# EAGLE design external_strip_v1 (EAGLE 7.2.0)
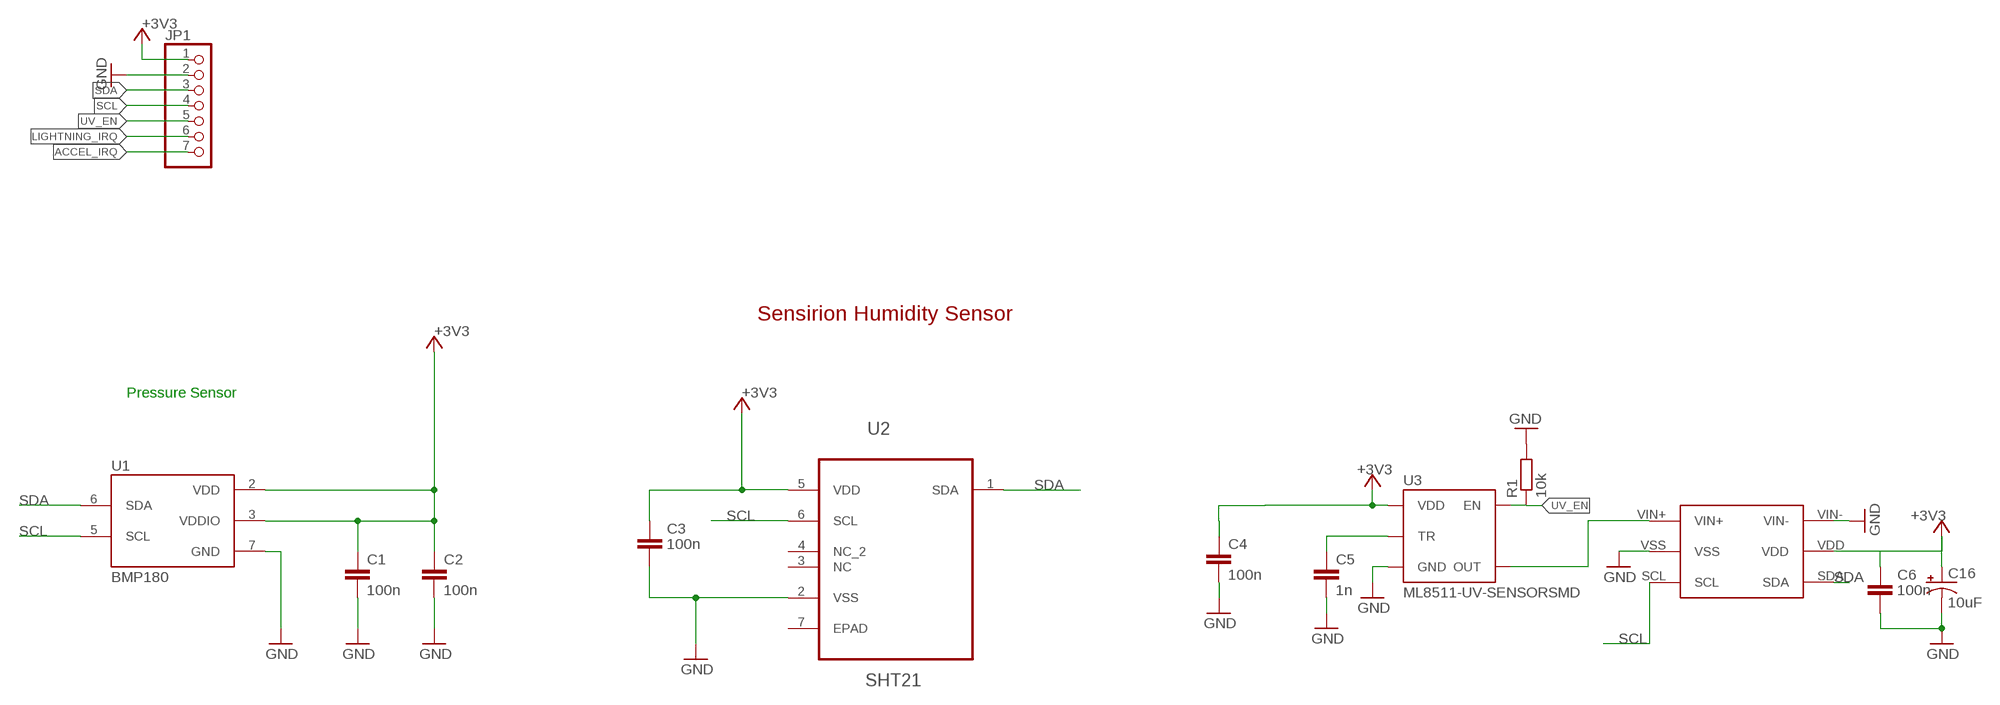
[diagram p0: schematic, sheet 1, part 1 of 2]
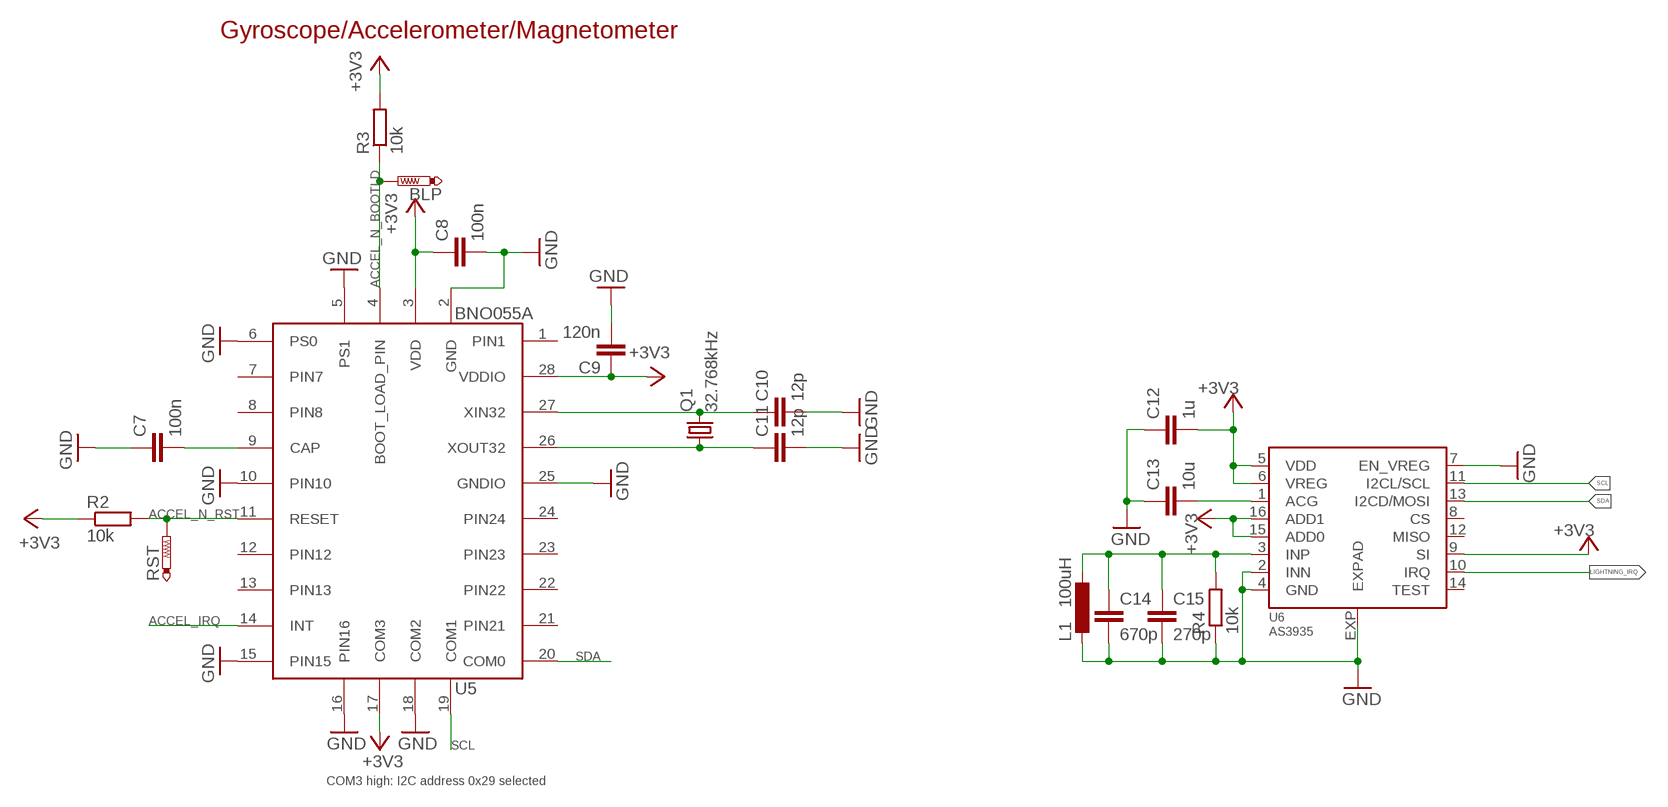
[diagram p1: schematic, sheet 1, part 2 of 2]

## Parts
BLP  PTR1B1,27  [B1,27]
C1  100n  C-EUC0603  [C0603]
C2  100n  C-EUC0603  [C0603]
C3  100n  C-EUC0603  [C0603]
C4  100n  0.1UF-25V(+80/-20%)(0603)  [0603-CAP]
C5  1n  1NF/1000PF-50V-10%(0603)  [0603-CAP]
C6  100n  C-EUC0603  [C0603]
C7  100n  C-EUC0603  [C0603]
C8  100n  C-EUC0603  [C0603]
C9  120n  C-EUC0603  [C0603]
C10  12p  C-EUC0603  [C0603]
C11  12p  C-EUC0603  [C0603]
C12  1u  C-EUC0603  [C0603]
C13  10u  C-EUC0603  [C0603]
C14  670p  C-EUC0603  [C0603]
C15  270p  C-EUC0603  [C0603]
C16  10uF  10UF-TANT  [EIA3216]
JP1  PINHD-1X7  [1X07]
L1  100uH  COILCRAFT  [COILCRAFT]
Q1  32.768kHz  FC-12M  [FC-12M]
R1  10k  R-EU_R0603  [R0603]
R2  10k  R-EU_R0603  [R0603]
R3  10k  R-EU_R0603  [R0603]
R4  10k  R-EU_R0603  [R0603]
RST  PTR1B1,27  [B1,27]
U1  BMP180  [BMP180]
U2  SHT21  [DFN300X300X110-7N]
U3  ML8511-UV-SENSORSMD  [ML8511]
U4  MCP3425  [SOT-23-6]
U5  BNO055A  [BNO055]
U6  AS3935  [16LDMLPQ]

## Nets
+3V3 [power]: C1.1 C2.1 C3.1 C4.1 C6.1 C8.1 C9.1 C12.2 C16.A(+) JP1.1 R2.1 R3.2 U1.2(VDD) U1.3(VDDIO) U2.5(VDD) U3.7(VDD) U4.VDD U5.3(VDD) U5.17(COM3) U5.28(VDDIO) U6.5(VDD) U6.6(VREG) U6.9(SI) U6.15(ADD0) U6.16(ADD1)
ACCEL_IRQ: JP1.7 U5.14(INT)
ACCEL_N_BOOTLD: BLP.TP R3.1 U5.4(BOOT_LOAD_PIN)
ACCEL_N_RST: R2.2 RST.TP U5.11(RESET)
GND: C1.2 C2.2 C3.2 C4.2 C5.2 C6.2 C7.1 C8.2 C9.2 C10.2 C11.2 C12.1 C13.1 C14.2 C15.2 C16.C(-) JP1.2 L1.2 R1.2 R4.1 U1.7(GND) U2.2(VSS) U3.5(GND) U4.VIN- U4.VSS U5.2(GND) U5.5(PS1) U5.6(PS0) U5.10(PIN10) U5.15(PIN15) U5.16(PIN16) U5.18(COM2) U5.25(GNDIO) U6.2(INN) U6.4(GND) U6.7(EN_VREG) U6.EXP(EXPAD)
LIGHTNING_IRQ: JP1.6 U6.10(IRQ)
N$1: U3.8(OUT) U4.VIN+
N$2: C13.2 U6.1(ACG)
N$3: C5.1 U3.10(TR)
N$5: C14.1 C15.1 L1.1 R4.2 U6.3(INP)
N$18: C7.2 U5.9(CAP)
N$19: C10.1 Q1.2 U5.27(XIN32)
N$73: C11.1 Q1.1 U5.26(XOUT32)
SCL: JP1.4 U1.5(SCL) U2.6(SCL) U4.SCL U5.19(COM1) U6.11(I2CL/SCL)
SDA: JP1.3 U1.6(SDA) U2.1(SDA) U4.SDA U5.20(COM0) U6.13(I2CD/MOSI)
UV_EN: JP1.5 R1.1 U3.4(EN)
Unconnected: U2.3(NC) U2.4(NC_2) U2.7(EPAD) U5.1(PIN1) U5.7(PIN7) U5.8(PIN8) U5.12(PIN12) U5.13(PIN13) U5.21(PIN21) U5.22(PIN22) U5.23(PIN23) U5.24(PIN24) U6.8(CS) U6.12(MISO) U6.14(TEST)

## Notes on the sheet
- Gyroscope/Accelerometer/Magnetometer
- Sensirion Humidity Sensor
- Pressure Sensor
- COM3 high: I2C address 0x29 selected

## Library data of the parts
BLP RST = testpad:PTR1: TEST PIN
C1-C3 C6-C15 = rcl:C-EU: CAPACITOR, European symbol
C4 = SparkFun-Capacitors:0.1UF-25V(+80/-20%)(0603): CAP-00810 Ceramic Standard decoupling cap; PROD_ID: CAP-00810; VALUE: 0.1uF
C5 = SparkFun-Capacitors:1NF/1000PF-50V-10%(0603): CAP-07886; PROD_ID: CAP-07886; VALUE: 1nF
C16 = SparkFun-Retired:10UF-TANT: 10uF Tantalum SMT CAP-00811- 16V 10% (EIA-3216); PROD_ID: CAP-00811
JP1 = pinhead:PINHD-1X7: PIN HEADER
L1 = AS3935:COILCRAFT
Q1 = crystal:FC-12M: kHz RANGE CRYSTAL UNIT LOW PROFILE SMD Source: Epson Toyocom FC-12M.pdf; URL: http://www.mouser.ch/ProductDetail/ECS/ECS-327-125-12-TR/?qs=sGAEpiMZZMsBj6bBr9Q9adKxTNdvE4KvM1b8HDkgjuY%3d
R1 R4 = resistor:R-EU_: RESISTOR, European symbol
R2 R3 = rcl:R-EU_: RESISTOR, European symbol
U1 = SparkFun-Sensors:BMP180: BOSCH BMP180 DIGITAL BAROMETRIC PRESSURE SENSOR Web page: http://www.bosch-sensortec.com/en/homepage/products_3/environmental_sensors_1/bmp180_1/bmp180 Datasheet: http://ae-bst.resource.bosch.com/media/products/dokumente/bmp180/BST-BMP180-DS000-09.pdf The BMP180 is the function compatible successor of the BMP085, a new generation of high precision digital pressure sensors for consumer applications. The ultra-low power, low voltage electronics of the BMP180 is optimized for use in mobile phones, PDAs, GPS navigation devices and outdoor equipment. With a low altitude noise of merely 0.25m at fast conversion time, the BMP180 offers superior performance. The I2C interface allows for easy system integration with a microcontroller. The BMP180 is based on piezo-resistive technology for EMC robustness, high accuracy and linearity as well as long term stability. Key features: - Temperature measurement included - I2C interface - Fully calibrated - Pb-free, halogen-free and RoHS compliant, - MSL 1 Basic specs: Pressure range: 300 to 1100hPa (+9000m to -500m relating to sea level) Supply voltage: 1.8 to 3.6V (VDD), 1.62V to 3.6V (VDDIO) Package: LGA package with metal lid Small footprint: 3.6mm x 3.8mm Super-flat: 0.93mm height Low power: 5μA at 1 sample / sec. in standard mode Low noise: 0.06hPa (0.5m) in ultra low power mode, 0.02hPa (0.17m) advanced resolution mode Typical applications: - Enhancement of GPS navigation (dead-reckoning, slope detection, etc.) - In- and out-door navigation - Leisure and sports - Weather forecast - Vertical velocity indication (rise/sink speed)
U2 = SENSIRION-SHT21:SHT21: SENSOR, HUMIDITY & TEMP; MPN: SHT21; OC_FARNELL: 1855468; OC_NEWARK: 20T1172; PACKAGE: DFN-6; SUPPLIER: SENSIRION
U3 = SparkFun-Sensors:ML8511-UV-SENSOR; PROD_ID: IC-11927
U4 = phMeter:MCP3425
U5 = BNO055:BNO055
U6 = AS3935:AS3935

## Net classes
0 default: width 0.305 mm
1 power: width 0.203 mm, drill 0.305 mm, clearance 0.152 mm

## Board
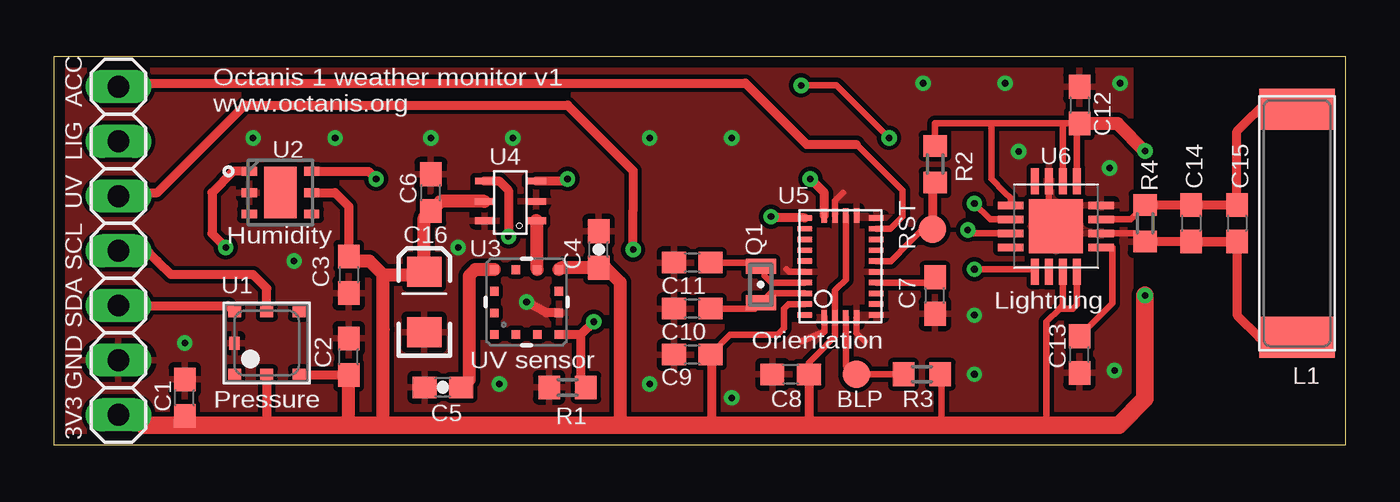
[diagram p2: board, top side]
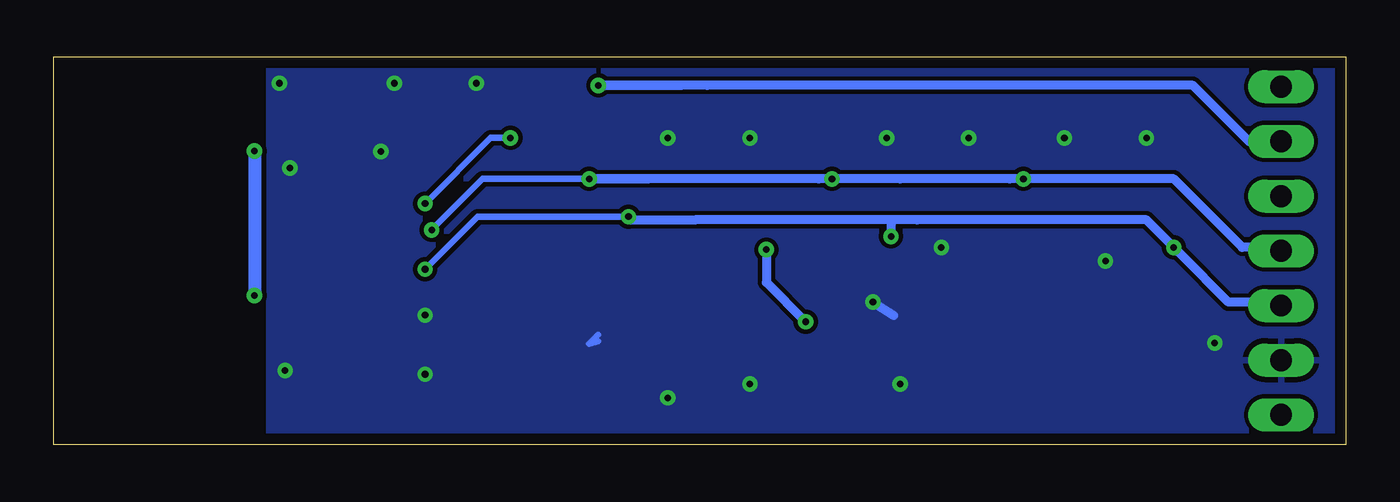
[diagram p3: board, bottom side, seen from below]

Size 60 x 18 mm. Coordinates in mm from the lower left corner, seen from the top.
Outline: 0,0 60,0 60,18 0,18 0,0
Copper layers (1*16): Top 0.035mm / dielectric 1.5mm / Bottom 0.035mm
Design rules "default *": minimum track width 10mil, minimum drill 24mil, track to track 8mil, track to pad 8mil, pad to pad 8mil, via to via 8mil, smd to smd 8mil, copper to edge 20mil, drill to drill 8mil, minimum pad ring 10mil, minimum via ring 8mil, stop-mask expansion 4mil, vias tented up to drill 0mil, thermal gap 10mil

### Footprints (pad centres in the part's own frame; a part is rotated, then mirrored left to right if it is on the bottom)
B1,27 = smd 1.27 x 1.27: TP 0,0
C0603 = smd 1.1 x 1: 1 -0.85,0; 2 0.85,0
0603-CAP = smd 1.1 x 1: 1 -0.85,0; 2 0.85,0
EIA3216 = smd 1.4 x 1.6: A 1.4,0; C -1.4,0
1X07 = drill 1.016 long: 1 -7.62,0; 2 -5.08,0; 3 -2.54,0; 4 0,0; 5 2.54,0; 6 5.08,0; 7 7.62,0
COILCRAFT = smd 1.9 x 3.5: 1 -5.3,0.05; 2 5.3,0.05
FC-12M = smd 0.7 x 1.4: 1 -0.85,0; 2 0.85,0
R0603 = smd 1 x 1.1: 1 -0.85,0; 2 0.85,0
BMP180 = smd 0.6 x 0.5: 1 1.5,1.45; 2 0,1.45; 3 -1.5,1.45; 4 -1.5,-1.45; 5 0,-1.45; 6 1.5,-1.45 | smd 0.5 x 0.6: 7 1.5,0
DFN300X300X110-7N = smd 0.711 x 0.406: 1 -1.448,0.991; 2 -1.448,0; 3 -1.448,-0.991; 4 1.448,-0.991; 5 1.448,0; 6 1.448,0.991 | smd 1.499 x 2.388: 7 0,0
ML8511 = smd 0.4 x 0.4: 1 1.5,-1.5; 2 1.5,-0.5; 3 1.5,0.5; 4 1.5,1.5; 5 0.5,1.5; 6 -0.5,1.5; 7 -1.5,1.5; 8 -1.5,0.5; 9 -1.5,-0.5; 10 -1.5,-1.5; 11 -0.5,-1.5; 12 0.5,-1.5
SOT-23-6 = smd 0.305 x 0.9: SCL 2.45,-0.45; SDA 2.45,1.95; VDD 1.5,1.95; VIN+ 0.6,-0.45; VIN- 0.6,1.95; VSS 1.5,-0.45
BNO055 = smd 0.675 x 0.25: 1 1.663,2.25; 6 -1.665,2.25; 7 -1.665,1.75; 8 -1.665,1.25; 9 -1.665,0.75; 10 -1.665,0.25; 11 -1.665,-0.25; 12 -1.665,-0.75; 13 -1.665,-1.25; 14 -1.665,-1.75; 15 -1.665,-2.25; 20 1.663,-2.25; 21 1.663,-1.75; 22 1.663,-1.25; 23 1.663,-0.75; 24 1.663,-0.25; 25 1.663,0.25; 26 1.663,0.75; 27 1.663,1.25; 28 1.663,1.75 | smd 0.25 x 0.675: 2 0.75,2.362; 3 0.25,2.362; 4 -0.25,2.362; 5 -0.75,2.362; 16 -0.75,-2.362; 17 -0.25,-2.362; 18 0.25,-2.362; 19 0.75,-2.362
16LDMLPQ = smd 1.2 x 0.35: 1 -2.1,0.975; 2 -2.1,0.325; 3 -2.1,-0.325; 4 -2.1,-0.975; 9 2.1,-0.975; 10 2.1,-0.325; 11 2.1,0.325; 12 2.1,0.975 | smd 0.35 x 1.2: 5 -0.975,-2.1; 6 -0.325,-2.1; 7 0.325,-2.1; 8 0.975,-2.1; 13 0.975,2.1; 14 0.325,2.1; 15 -0.325,2.1; 16 -0.975,2.1 | smd 2.5 x 2.5: EXP 0,0

### Placement (x,y rotation side)
BLP  37.27,3.27 0 top
C1  6.08,2.17 90 top
C2  13.7,4.08 90 top
C3  13.7,7.89 270 top
C4  25.31,9.06 90 top
C5  18.07,2.66 180 top
C6  17.51,11.7 90 top
C7  40.93,6.92 90 top
C8  34.22,3.27 180 top
C9  29.65,4.18 180 top
C10  29.65,6.32 180 top
C11  29.65,8.45 180 top
C12  47.63,15.76 270 top
C13  47.63,4.18 90 top
C14  52.82,10.28 270 top
C15  54.95,10.28 270 top
C16  17.21,6.62 90 top
JP1  3,9 90 top
L1  57.69,10.28 270 top
Q1  32.84,7.43 270 top
R1  23.86,2.66 180 top
R2  40.93,13.02 270 top
R3  40.32,3.27 0 top
R4  50.68,10.28 90 top
RST  40.81,9.99 0 top
U1  9.89,4.71 180 top
U2  10.53,11.7 0 top
U3  21.95,6.62 270 top
U4  21.95,9.79 90 top
U5  36.54,8.27 180 top
U6  46.54,10.13 180 top

### Tracks (layer width: path | path; a pad name or v marks a point on that pad's centre or on a via)
+3V3  (via drill 0.3)
  Top 0.305: U5.17 36.79,7.66 36.36,7.23 36.29,7.16 | 36.29,7.16 U5.3 | U5.28 34.13,6.52 33.92,6.32 33.92,5.4 33.61,5.1 31.42,5.1 C9.1 | 49.46,0.91 45.81,0.91 | 45.81,0.91 41.23,0.91 | 41.23,0.91 35.14,0.91 30.64,0.91 30.57,0.83 | 36.29,7.16 36.29,5.03 35.44,4.18 35.07,3.81 C8.1 | R3.2 arc-90 41.23,3.2 41.23,0.91 | U6.16 47.52,6.5 47.33,6.32 46.72,6.32 | 46.72,6.32 46.11,5.71 46.11,1.21 45.81,0.91 | U6.15 46.87,6.46 46.72,6.32 | U6.5 47.52,14.79 C12.2 46.87,14.91 | U6.6 46.87,14.91 | R2.1 40.93,14.91 43.55,14.91 | 43.55,14.91 43.81,14.91 | 43.81,14.91 44.28,14.91 | 44.28,14.91 46.87,14.91 | 43.81,14.91 44.28,14.91 | U6.9 44.44,11.44 44.18,11.7 43.55,12.34 43.55,14.91
  Top 0.406: U1.2 9.89,0.91 | C1.1 6.08,0.91 | C2.1 11.43,3.23 U1.3 | U2.5 13.06,11.7 13.7,11.06 C3.1 | 30.57,0.83 30.57,4.12 C9.1 | C8.1 35.07,0.97 35.14,0.91
  Top 0.61: 13.7,0.91 C2.1 | 15.3,0.91 15.3,5.35 15.3,7.89 | 15.3,7.89 14.66,8.53 13.91,8.53 C3.1 | 15.3,7.89 17.38,7.89 C16.A 17.2,10.54 C6.1 17.95,11.29 U4.VDD | 25.08,0.91 26.22,0.83 26.3,0.91 26.3,7.53 25.62,8.21 C4.1 23.54,8.21 U3.7 | C12.2 49.4,14.91 v50.68,13.63
  Top 0.813: JP1.1 3.16,1.54 3.54,1.54 4.17,0.91 6.08,0.91 9.89,0.91 13.7,0.91 15.3,0.91 25.08,0.91 35.14,0.91 41.23,0.91 45.81,0.91 49.46,0.91 50.68,2.12 v50.68,6.92
  Bottom 0.61: v50.68,13.63 v50.68,6.92
ACCEL_IRQ
  Top 0.305: U5.14 38.85,10.02 39.41,10.58 39.41,11.8 37.27,13.94
  Top 0.406: JP1.7 3.16,16.78 32.11,16.78 34.96,13.94 37.27,13.94
ACCEL_N_BOOTLD
  Top 0.305: U5.4 36.79,3.75 arc90 BLP.TP R3.1
ACCEL_N_RST
  Top 0.305: U5.11 38.87,8.52 39.71,9.36 40.34,9.99 RST.TP
  Top 0.406: R2.2 40.81,12.05 RST.TP
GND  (via drill 0.3)
  Top 0.305: R4.1 50.3,9.81 U6.2 | U6.EXP 46.22,10.46 U6.7 | U5.2 35.79,5.24 34.73,4.79 | U5.25 34.14,8.02 34.02,8.14 | U5.5 37.29,5.18 37.68,4.79 | U5.18 36.29,11.32 36.66,11.7
  Top 0.406: U3.5 22.88,6.12 v21.95,6.62 | C15.2 C14.2 | C14.2 R4.1 | C14.2 C15.2 | L1.2 55.98,4.98 54.98,5.99 54.98,9.4 C15.2
  Bottom 0.305: 34.73,4.79 35.14,4.69 34.73,5.1
  Bottom 0.406: v21.95,6.62 21,6
  other vias: 20.68,2.81 49.03,12.84 42.76,6.01 42.76,3.27 40.37,16.78 44.18,16.78 49.53,16.78 21.32,14.24 17.51,14.24 13.06,14.24 9.26,14.24 11.16,8.53 31.48,14.24 27.67,14.24 27.67,2.81 31.48,2.17 49.26,3.45 44.81,13.61 6.08,4.71 18.78,9.16
  pour Bottom: 0,18 50,18 50,-0.3 0,-0.3
  pour Top: 0,18 50,18 50,-0.3 0,-0.3
LIGHTNING_IRQ  (via drill 0.3)
  Top 0.305: U6.10 43.49,10.46 v42.76,11.19 | v38.8,14.24 36.36,16.68 v34.71,16.68
  Bottom 0.305: v42.76,11.19 39.71,14.24 v38.8,14.24 | v34.71,16.68 29.65,16.68
  Bottom 0.406: JP1.6 4.5,14.08 5.57,15.15 7.1,16.68 29.65,16.68 v34.71,16.68 30.87,16.68
N$1
  Top 0.61: U3.8 22.45,10.35 U4.VIN+
N$2
  Top 0.305: U6.1 49.16,9.16 49.16,7.84 49.16,6.56 C13.2
N$3
  Top 0.61: U3.10 19.57,8.12 19.29,7.84 19.29,3.03 C5.1
N$5
  Top 0.305: U6.3 50.01,10.46 R4.2
  Top 0.406: R4.2 C14.1 | C14.1 C15.1 | C15.1 54.95,14.54 56.47,16.07 57.25,16.07 L1.1 | C14.1 C15.1
N$18
  Top 0.305: U5.9 40.93,7.52 C7.2
N$19
  Top 0.305: U5.27 33.28,7.02 Q1.2 32.57,6.32 C10.1
N$73
  Top 0.305: U5.26 33.32,7.52 33,7.84 33,8.11 Q1.1 32.67,8.45 C11.1
SCL  (via drill 0.3)
  Top 0.305: U6.11 42.62,9.81 v42.45,9.97
  Top 0.406: U2.6 14.61,12.69 v14.97,12.34 | U1.5 9.89,7.26 9.26,7.89 6.08,7.89 5.45,7.89 4.81,8.53 4.17,9.16 3.16,9.16 JP1.4 | U4.SCL 23.77,12.24 v23.86,12.34 | U5.19 35.79,11.69 v35.14,12.34
  Bottom 0.305: v42.45,9.97 40.09,12.34 v35.14,12.34
  Bottom 0.406: JP1.4 3.16,9.16 4.81,9.16 7.99,12.34 v14.97,12.34 | v14.97,12.34 15.61,12.34 | 15.61,12.34 20.68,12.34 v23.86,12.34 | v23.86,12.34 24.47,12.34 | 24.47,12.34 32.39,12.34 | 32.39,12.34 v35.14,12.34 | v35.14,12.34 35.29,12.34 | v14.97,12.34 15.61,12.34 | v23.86,12.34 24.47,12.34 | v35.14,12.34 32.39,12.34
SDA  (via drill 0.3)
  Top 0.305: U6.13 45.45,8.14 v42.76,8.14
  Top 0.406: JP1.3 8.09,6.46 U1.6 | U2.1 8.34,12.69 7.35,11.7 7.35,9.79 v7.99,9.16 | U4.SDA 20.67,12.24 21.12,11.8 v21.12,9.67 | U5.20 33.37,10.52 v33.31,10.58
  Bottom 0.305: v42.76,8.14 40.32,10.58 v33.31,10.58
  Bottom 0.406: JP1.3 3.16,6.62 5.45,6.62 7.67,8.84 | 7.67,8.84 v7.99,9.16 | v7.99,9.16 9.26,10.43 19.9,10.43 | 19.9,10.43 30.21,10.43 33.16,10.43 v33.31,10.58 | v7.99,9.16 7.67,8.84 | 19.9,10.43 20.96,10.43 21.12,10.28 v21.12,9.67
UV_EN  (via drill 0.3)
  Top 0.406: JP1.5 3.16,11.7 4.81,11.7 8.87,15.76 23.86,15.76 26.91,12.72 26.91,10.89 v26.91,9.06 | v25.08,5.71 24.49,5.12 U3.4 24.47,5.1 24.47,2.72 R1.1
  Bottom 0.406: v26.91,9.06 26.91,7.53 v25.08,5.71

### Text on the board
tNames: Octanis 1 weather monitor v1 | www.octanis.org | U4 | Humidity | U3 | Lightning | UV sensor | Orientation | Pressure | 3V3 GND SDA SCL UV LIG ACC
tValues: MCP3425 | ML8511